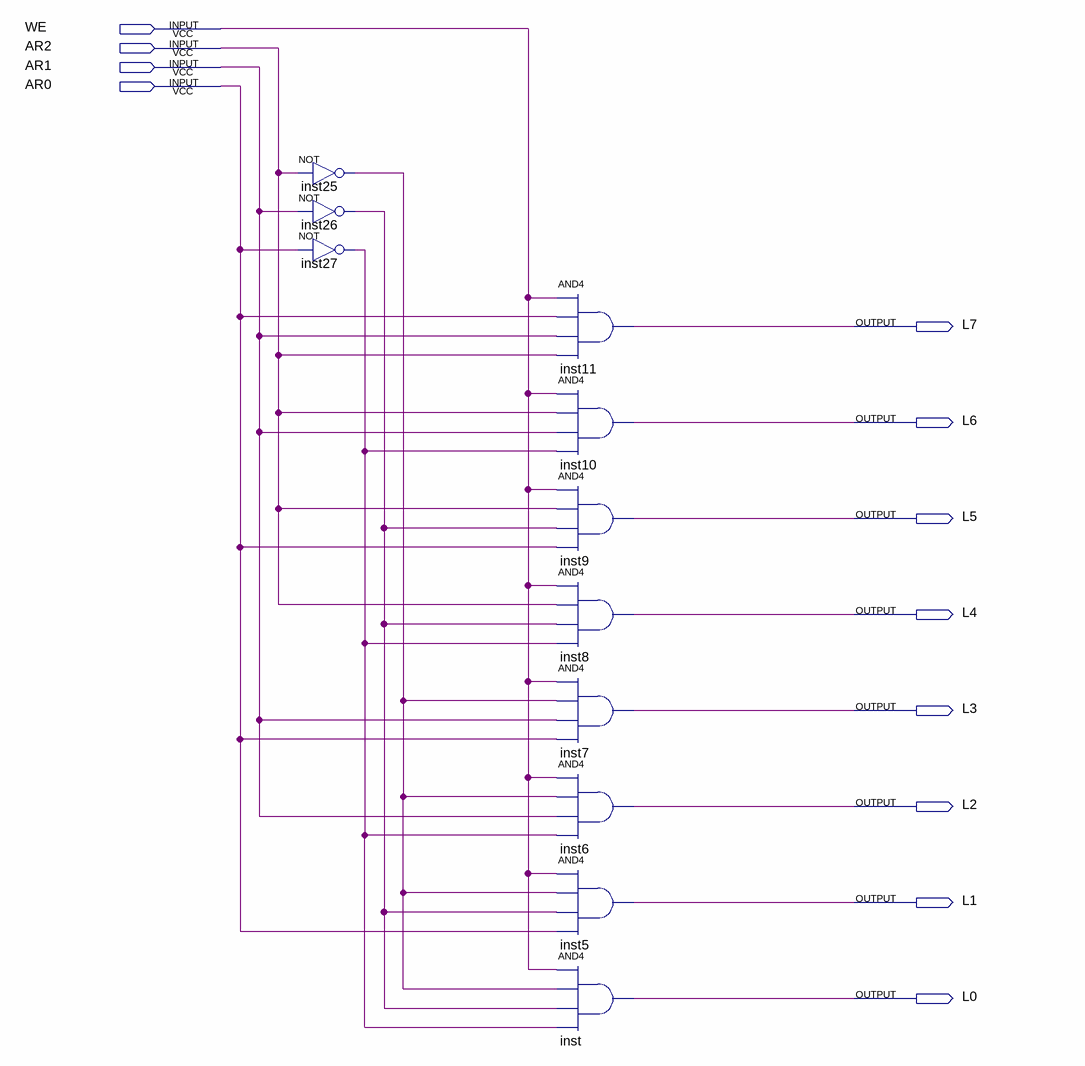
[diagram p0: schematic sheet]
// Quartus schematic 2_4WE.bdf as structural Verilog: 11 symbols, 12 pins
module \2_4WE  (
  input  WE,
  input  AR2,
  input  AR1,
  input  AR0,
  output L7,
  output L6,
  output L5,
  output L4,
  output L3,
  output L2,
  output L1,
  output L0
);

  wire inst25_out, inst26_out, inst27_out;

  not inst25 (inst25_out, AR2);
  not inst26 (inst26_out, AR1);
  not inst27 (inst27_out, AR0);
  and inst11 (L7, WE, AR0, AR1, AR2);
  and inst10 (L6, WE, AR2, AR1, inst27_out);
  and inst9 (L5, WE, AR2, inst26_out, AR0);
  and inst8 (L4, WE, AR2, inst26_out, inst27_out);
  and inst7 (L3, WE, inst25_out, AR1, AR0);
  and inst6 (L2, WE, inst25_out, AR1, inst27_out);
  and inst5 (L1, WE, inst25_out, inst26_out, AR0);
  and inst (L0, WE, inst25_out, inst26_out, inst27_out);
endmodule
